# EAGLE design skv_v3 (EAGLE 6.5.0)
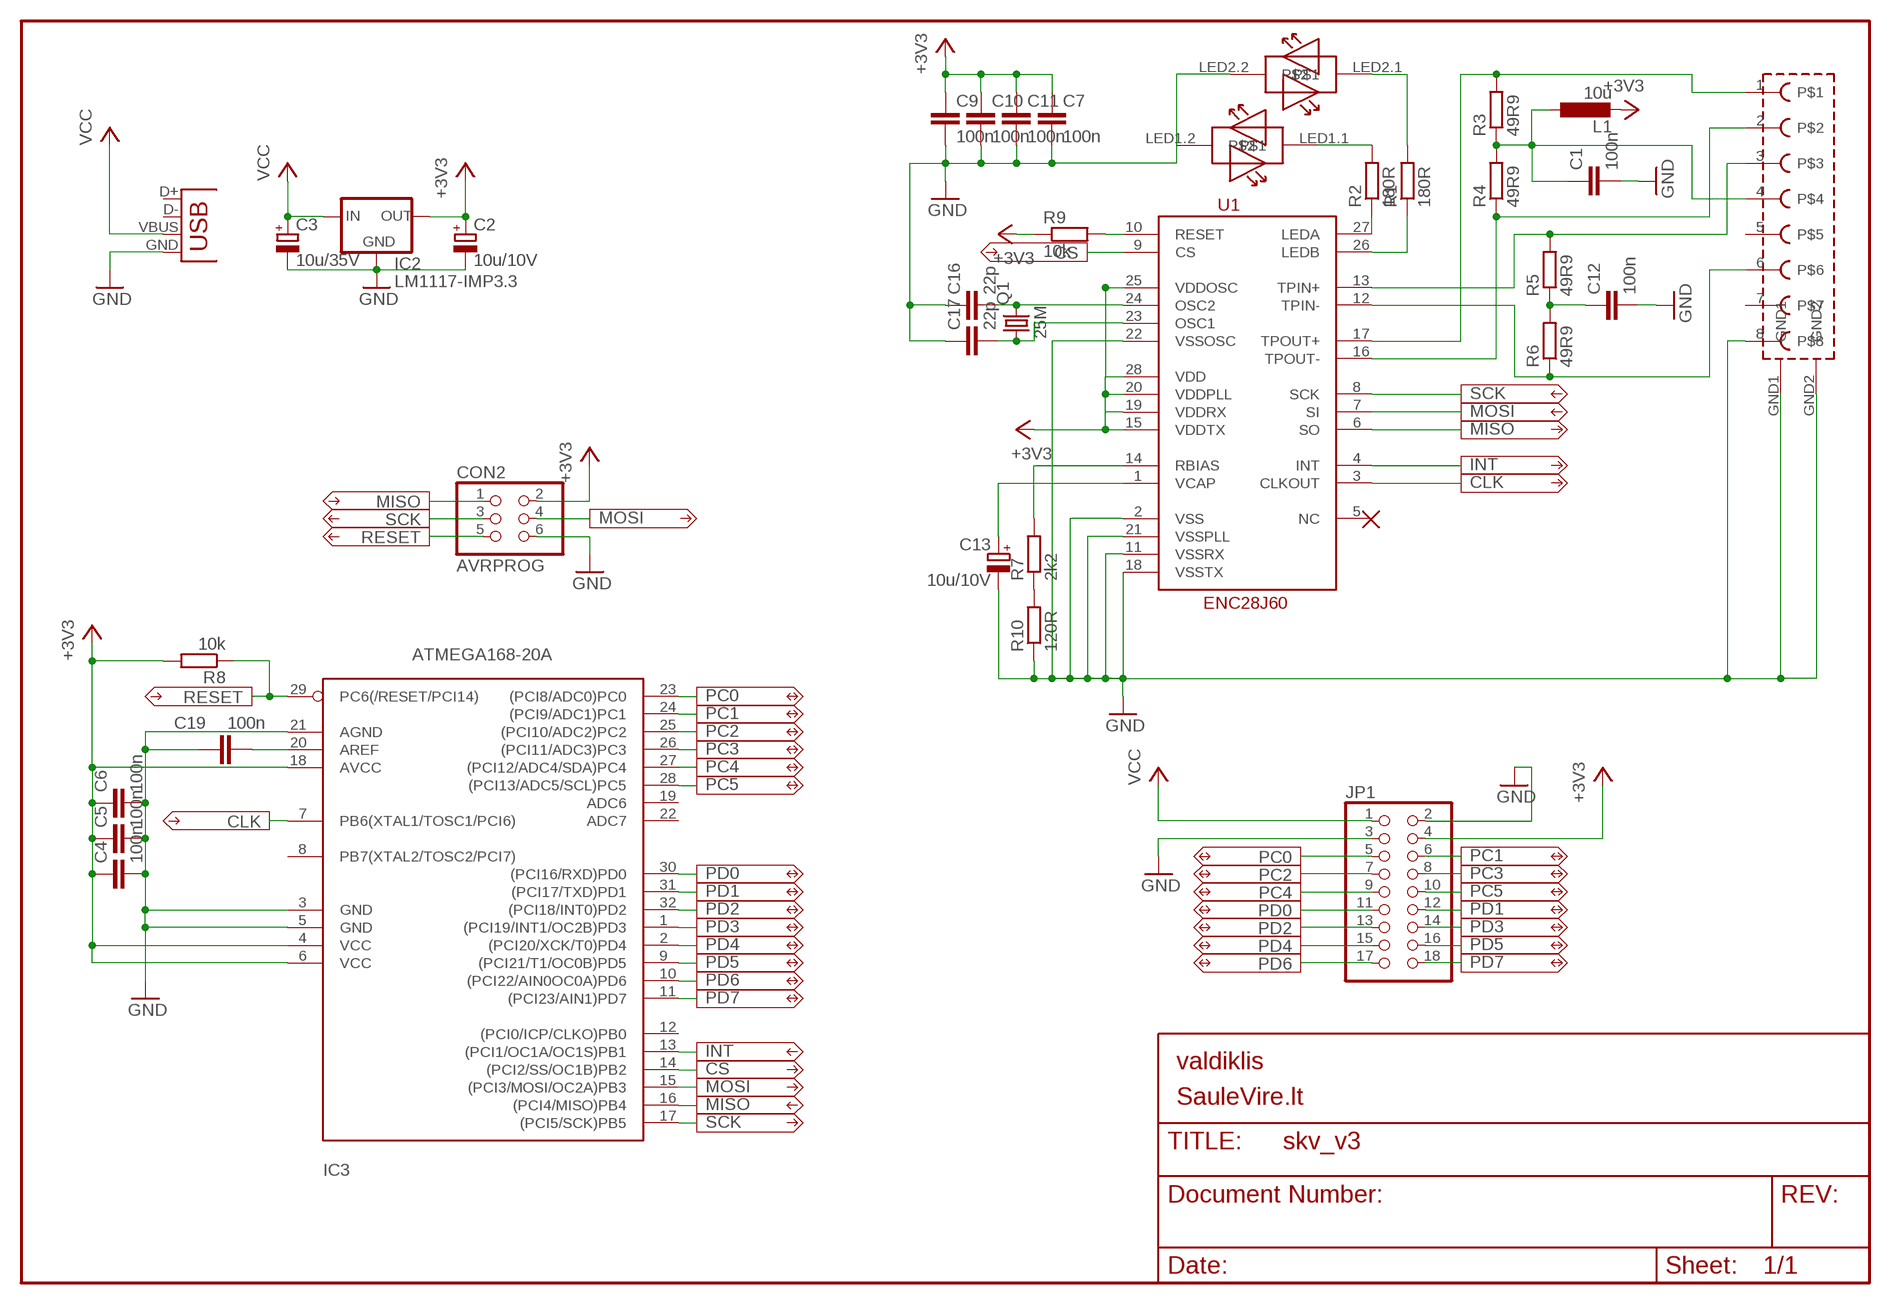
[diagram p0: schematic, sheet 1]

## Parts
C1  100n  C-EUC0805  [C0805]
C2  10u/10V  CPOL-EUSMCA  [SMC_A]
C3  10u/35V  CPOL-EUSMCC  [SMC_C]
C4  100n  C-EUC0805  [C0805]
C5  100n  C-EUC0805  [C0805]
C6  100n  C-EUC0805  [C0805]
C7  100n  C-EUC0805  [C0805]
C9  100n  C-EUC0805  [C0805]
C10  100n  C-EUC0805  [C0805]
C11  100n  C-EUC0805  [C0805]
C12  100n  C-EUC0805  [C0805]
C13  10u/10V  CPOL-EUSMCA  [SMC_A]
C16  22p  C-EUC0805  [C0805]
C17  22p  C-EUC0805  [C0805]
C19  100n  C-EUC0805  [C0805]
CON2  AVRPROG  PINHD-2X3_2.54  [2X03]
IC2  LM1117-IMP3.3  LM1117  [SOT223]
IC3  ATMEGA168-20A  [TQFP32-08]
JP1  PINHD-2X9  [2X09]
L1  10u  L-EU0207/10  [0207/10]
MAGJACK  MAGJACK  [MAGJACK]
Q1  25M  CRYSTALHC49UP  [HC49UP]
R1  180R  R-EU_R0805  [R0805]
R2  180R  R-EU_R0805  [R0805]
R3  49R9  R-EU_R0805  [R0805]
R4  49R9  R-EU_R0805  [R0805]
R5  49R9  R-EU_R0805  [R0805]
R6  49R9  R-EU_R0805  [R0805]
R7  2k2  R-EU_R0805  [R0805]
R8  10k  R-EU_R0805  [R0805]
R9  10k  R-EU_R0805  [R0805]
R10  120R  R-EU_R0805  [R0805]
U1  ENC28J60-1  [SSOP28]
X1  USB-MICROB  [USB-MICROB]

## Nets
+3V3: C2.+ C4.1 C5.1 C6.1 C7.1 C9.1 C10.1 C11.1 CON2.2 IC2.2(OUT) IC3.4(VCC) IC3.6(VCC) IC3.18(AVCC) JP1.4 L1.2 R8.2 R9.1 U1.15(VDDTX) U1.19(VDDRX) U1.20(VDDPLL) U1.25(VDDOSC) U1.28(VDD)
CLK: IC3.7(PB6(XTAL1/TOSC1/PCI6)) U1.3(CLKOUT)
CS: IC3.14((PCI2/SS/OC1B)PB2) U1.9(CS)
GND: C1.2 C2.- C3.- C4.2 C5.2 C6.2 C7.2 C9.2 C10.2 C11.2 C12.2 C13.- C16.1 C17.1 C19.1 CON2.6 IC2.1(GND) IC3.3(GND) IC3.5(GND) IC3.21(AGND) JP1.2 JP1.3 MAGJACK.8 MAGJACK.GND1 MAGJACK.GND2 MAGJACK.LED1.2 MAGJACK.LED2.2 R10.1 U1.2(VSS) U1.11(VSSRX) U1.18(VSSTX) U1.21(VSSPLL) U1.22(VSSOSC) X1.GND
INT: IC3.13((PCI1/OC1A/OC1S)PB1) U1.4(INT)
MISO: CON2.1 IC3.16((PCI4/MISO)PB4) U1.6(SO)
MOSI: CON2.4 IC3.15((PCI3/MOSI/OC2A)PB3) U1.7(SI)
N$1: R7.1 R10.2
N$9: C13.+ U1.1(VCAP)
N$10: R7.2 U1.14(RBIAS)
N$11: C17.2 Q1.1 U1.23(OSC1)
N$12: C16.2 Q1.2 U1.24(OSC2)
N$14: R2.1 U1.27(LEDA)
N$16: C19.2 IC3.20(AREF)
N$33: R1.1 U1.26(LEDB)
N$36: MAGJACK.LED1.1 R2.2
N$37: R9.2 U1.10(RESET)
N$39: MAGJACK.LED2.1 R1.2
N$40: C1.1 L1.1 MAGJACK.4 R3.1 R4.2
N$41: C12.1 R5.1 R6.2
N$42: MAGJACK.6 R6.1 U1.12(TPIN-)
N$43: MAGJACK.3 R5.2 U1.13(TPIN+)
N$44: MAGJACK.2 R4.1 U1.16(TPOUT-)
N$45: MAGJACK.1 R3.2 U1.17(TPOUT+)
PC0: IC3.23((PCI8/ADC0)PC0) JP1.5
PC1: IC3.24((PCI9/ADC1)PC1) JP1.6
PC2: IC3.25((PCI10/ADC2)PC2) JP1.7
PC3: IC3.26((PCI11/ADC3)PC3) JP1.8
PC4: IC3.27((PCI12/ADC4/SDA)PC4) JP1.9
PC5: IC3.28((PCI13/ADC5/SCL)PC5) JP1.10
PD0: IC3.30((PCI16/RXD)PD0) JP1.11
PD1: IC3.31((PCI17/TXD)PD1) JP1.12
PD2: IC3.32((PCI18/INT0)PD2) JP1.13
PD3: IC3.1((PCI19/INT1/OC2B)PD3) JP1.14
PD4: IC3.2((PCI20/XCK/T0)PD4) JP1.15
PD5: IC3.9((PCI21/T1/OC0B)PD5) JP1.16
PD6: IC3.10((PCI22/AIN0OC0A)PD6) JP1.17
PD7: IC3.11((PCI23/AIN1)PD7) JP1.18
RESET: CON2.5 IC3.29(PC6(/RESET/PCI14)) R8.1
SCK: CON2.3 IC3.17((PCI5/SCK)PB5) U1.8(SCK)
VCC: C3.+ IC2.3(IN) JP1.1 X1.VBUS
Unconnected: IC3.8(PB7(XTAL2/TOSC2/PCI7)) IC3.12((PCI0/ICP/CLKO)PB0) IC3.19(ADC6) IC3.22(ADC7) MAGJACK.5 MAGJACK.7 U1.5(NC) X1.D+ X1.D-

## Notes on the sheet
- valdiklis
- SauleVire.lt

## Library data of the parts
C1 C4-C7 C9-C12 C16 C17 C19 = rcl:C-EU: CAPACITOR, European symbol
C2 C3 C13 = rcl:CPOL-EU: POLARIZED CAPACITOR, European symbol
CON2 = pinhead:PINHD-2X3: PIN HEADER
IC2 = v-reg-2:LM1117
IC3 = avr:ATMEGA168: MICROCONTROLLER 16 kBytes FLASH 1 kBytes SRAM 512 Bytes EEPROM USART 8-channel 10 bit ADC
JP1 = pinhead:PINHD-2X9: PIN HEADER
L1 = rcl:L-EU: INDUCTOR, European symbol
MAGJACK = magjacksmalldrill:MAGJACK
Q1 = crystal:CRYSTAL: CRYSTAL
R1-R10 = rcl:R-EU_: RESISTOR, European symbol
U1 = microchip-enc28j60:ENC28J60-1
X1 = SparkFun:USB: USB Connectors USB-B-PTH is fully proven SKU : PRT-00139 USB-miniB is fully proven SKU : PRT-00587 USB-A-PCB is untested. USB-A-H is throughly reviewed, but untested. Spark Fun Electronics SKU : PRT-00437 USB-B-SMT is throughly reviewed, but untested. Needs silkscreen touching up. USB-A-S has not been used/tested USB-MB-H has not been used/tested

## Board
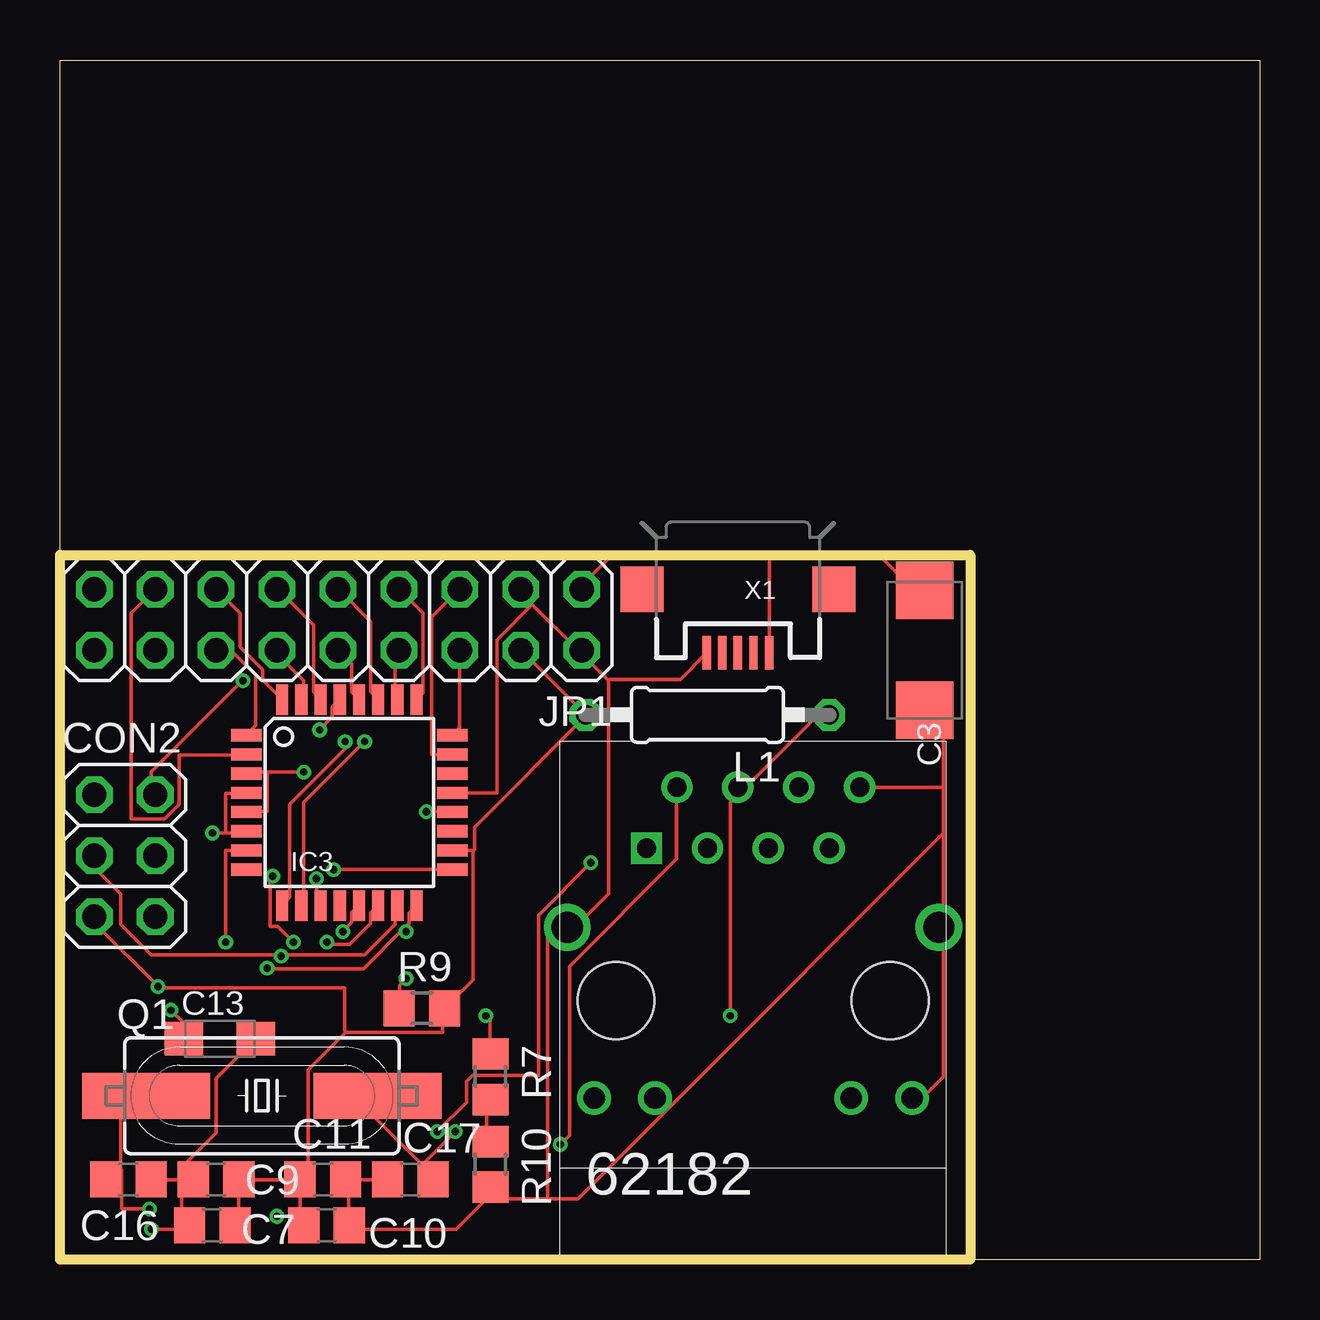
[diagram p1: board, top side]
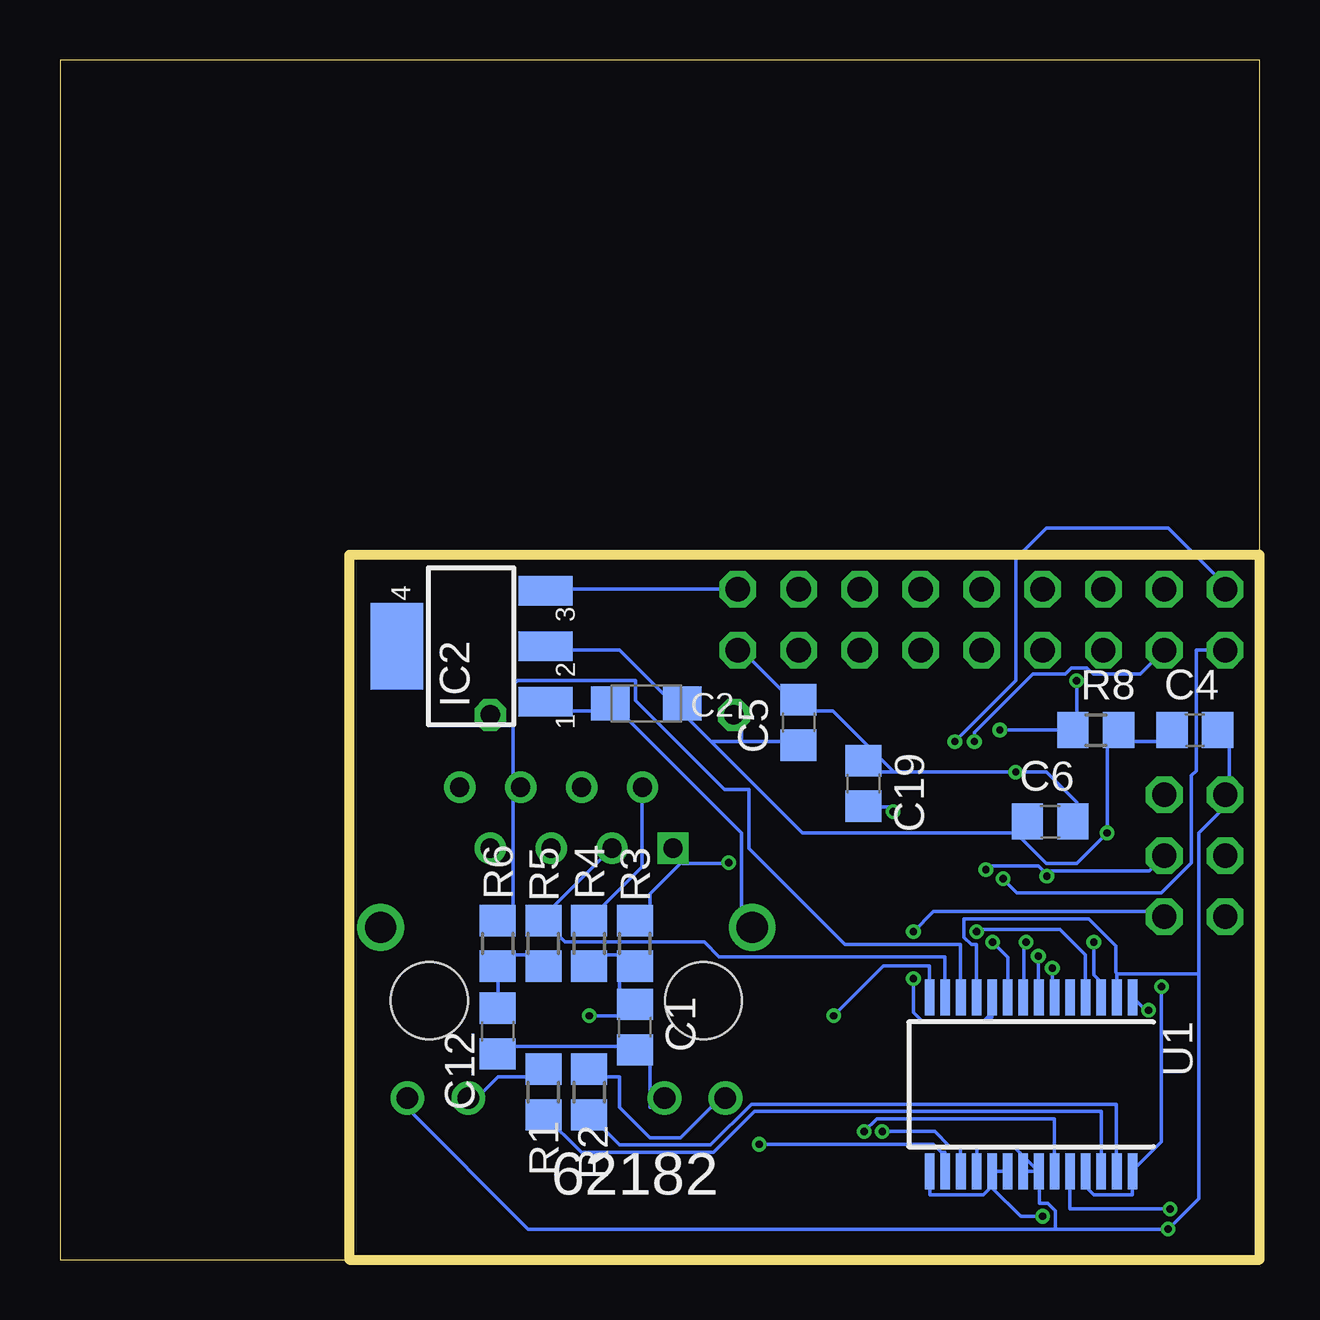
[diagram p2: board, bottom side, seen from below]

Size 50 x 50 mm. Coordinates in mm from the lower left corner, seen from the top.
Outline: 0,0 0,50 50,50 50,0 0,0
Copper layers (1*16): Top 0.035mm / dielectric 1.5mm / Bottom 0.035mm
Design rules "ITEADstudio_DRC": minimum track width 6mil, minimum drill 12mil, track to track 6mil, track to pad 6mil, pad to pad 6mil, via to via 6mil, smd to smd 0mil, copper to edge 10mil, drill to drill 10mil, minimum pad ring 10mil, minimum via ring 6mil, stop-mask expansion 2mil, vias tented up to drill 100mil, thermal gap 10mil
Milling: 4 lines

### Footprints (pad centres in the part's own frame; a part is rotated, then mirrored left to right if it is on the bottom)
C0805 = smd 1.3 x 1.5: 1 -0.95,0; 2 0.95,0
SMC_A = smd 1.6 x 1.4: + -1.5,0; - 1.5,0
SMC_C = smd 2.4 x 2.4: + -2.5,0; - 2.5,0
2X03 = drill 1.016 octagon: 1 -2.54,-1.27; 2 -2.54,1.27; 3 0,-1.27; 4 0,1.27; 5 2.54,-1.27; 6 2.54,1.27
SOT223 = smd 1.219 x 2.235: 1 -2.311,-3.099; 2 0,-3.099; 3 2.311,-3.099 | smd 3.6 x 2.2: 4 0,3.099
TQFP32-08 = smd 1.27 x 0.508: 1 -4.293,2.8; 2 -4.293,2; 3 -4.293,1.2; 4 -4.293,0.4; 5 -4.293,-0.4; 6 -4.293,-1.2; 7 -4.293,-2; 8 -4.293,-2.8; 17 4.293,-2.8; 18 4.293,-2; 19 4.293,-1.2; 20 4.293,-0.4; 21 4.293,0.4; 22 4.293,1.2; 23 4.293,2; 24 4.293,2.8 | smd 0.508 x 1.27: 9 -2.8,-4.293; 10 -2,-4.293; 11 -1.2,-4.293; 12 -0.4,-4.293; 13 0.4,-4.293; 14 1.2,-4.293; 15 2,-4.293; 16 2.8,-4.293; 25 2.8,4.293; 26 2,4.293; 27 1.2,4.293; 28 0.4,4.293; 29 -0.4,4.293; 30 -1.2,4.293; 31 -2,4.293; 32 -2.8,4.293
2X09 = drill 1.016 octagon: 1 -10.16,-1.27; 2 -10.16,1.27; 3 -7.62,-1.27; 4 -7.62,1.27; 5 -5.08,-1.27; 6 -5.08,1.27; 7 -2.54,-1.27; 8 -2.54,1.27; 9 0,-1.27; 10 0,1.27; 11 2.54,-1.27; 12 2.54,1.27; 13 5.08,-1.27; 14 5.08,1.27; 15 7.62,-1.27; 16 7.62,1.27; 17 10.16,-1.27; 18 10.16,1.27
0207/10 = drill 0.813 octagon: 1 -5.08,0; 2 5.08,0
MAGJACK = drill 0.8 square: 1 -4.445,6.35 | drill 0.8: 2 -3.175,8.89; 3 -1.905,6.35; 4 -0.635,8.89; 5 0.635,6.35; 6 1.905,8.89; 7 3.175,6.35; 8 4.445,8.89 | drill 1.3: GND1 -7.747,3.048; GND2 7.747,3.048 | drill 0.9: LED1.1 -6.629,-4.064; LED1.2 -4.089,-4.064; LED2.1 4.089,-4.064; LED2.2 6.629,-4.064 | hole 3.2: -5.715,0; 5.715,0
HC49UP = smd 5.334 x 1.93: 1 -4.826,0; 2 4.826,0
R0805 = smd 1.3 x 1.5: 1 -0.95,0; 2 0.95,0
SSOP28 = smd 0.4 x 1.5: 1 -4.225,-3.625; 2 -3.575,-3.625; 3 -2.925,-3.625; 4 -2.275,-3.625; 5 -1.625,-3.625; 6 -0.975,-3.625; 7 -0.325,-3.625; 8 0.325,-3.625; 9 0.975,-3.625; 10 1.625,-3.625; 11 2.275,-3.625; 12 2.925,-3.625; 13 3.575,-3.625; 14 4.225,-3.625; 15 4.225,3.625; 16 3.575,3.625; 17 2.925,3.625; 18 2.275,3.625; 19 1.625,3.625; 20 0.975,3.625; 21 0.325,3.625; 22 -0.325,3.625; 23 -0.975,3.625; 24 -1.625,3.625; 25 -2.275,3.625; 26 -2.925,3.625; 27 -3.575,3.625; 28 -4.225,3.625
USB-MICROB = smd 0.35 x 1.4: D+ 0,2.65; D- -0.65,2.65; GND 1.3,2.65; ID 0.65,2.65; VBUS -1.3,2.65 | smd 1.8 x 1.9: MT1 -4,0; MT2 4,0

### Placement (x,y rotation side)
C1  26.04,9.68 270 bottom
C2  25.56,23.18 180 bottom
C3  36.04,25.4 270 top
C4  2.7,22.07 0 bottom
C5  19.21,22.38 90 bottom
C6  8.73,18.26 0 bottom
C7  6.35,1.43 180 top
C9  6.51,3.33 180 top
C10  11.11,1.43 0 top
C11  10.95,3.33 0 top
C12  31.75,9.53 270 bottom
C13  6.67,9.21 0 top
C16  2.86,3.33 180 top
C17  14.61,3.33 0 top
C19  16.51,19.84 270 bottom
CON2  2.7,16.83 90 top
IC2  32.86,25.56 90 bottom
IC3  12.06,19.05 0 top
JP1  11.59,26.67 180 top
L1  26.99,22.7 180 top
MAGJACK  28.89,10.8 0 top
Q1  8.41,6.83 180 top
R1  29.84,6.98 90 bottom
R2  27.94,6.98 90 bottom
R3  26.04,13.18 90 bottom
R4  27.94,13.18 270 bottom
R5  29.85,13.18 90 bottom
R6  31.75,13.18 270 bottom
R7  17.94,7.62 90 top
R8  6.83,22.07 0 bottom
R9  15.08,10.48 180 top
R10  17.94,3.97 90 top
U1  9.53,7.3 180 bottom
X1  28.26,27.94 180 top

### Tracks (layer width: path | path; a pad name or v marks a point on that pad's centre or on a via)
+3V3  (via drill 0.3)
  Top 0.152: v6.35,17.78 6.91,17.78 | 6.91,17.78 7.62,17.78 IC3.6 | 6.91,17.78 6.91,19.43 7.77,19.43 IC3.4 | CON2.2 1.45,14.28 1.45,14.02 v4.09,11.38 4.14,11.33 11.86,11.33 11.86,9.53 11.91,9.47 | JP1.4 19.23,25.4 21.89,22.73 21.89,22.71 L1.2 21.89,22.63 17.27,18.01 17.27,17.09 17.22,17.04 | C11.1 10.01,1.6 10.16,1.45 C10.1 9.96,1.8 v9.04,1.8 | C7.1 7.32,1.45 7.44,1.57 7.44,3.33 C9.1 7.52,3.33 9.93,3.33 C11.1 | 17.22,17.04 IC3.18 | 17.22,17.04 17.22,11.66 16.05,10.49 R9.1 15.95,10.46 15.95,9.47 11.91,9.47 | 11.91,9.47 10.34,7.9 10.34,3.71 10.03,3.4 C11.1
  Bottom 0.152: 6.35,21.59 v6.35,17.78 7.62,16.51 8.89,16.51 10.16,17.78 | 6.35,21.59 3.81,21.59 C4.1 | 6.35,21.59 R8.2 | 10.16,17.78 19.05,17.78 22.86,21.59 | 24.13,22.86 22.86,21.59 | 22.86,21.59 21.59,21.59 | 21.59,21.59 19.05,21.59 C5.1 | 24.13,22.86 26.67,25.4 29.21,25.4 IC2.2 | 24.13,22.86 C2.+ | 10.16,17.78 C6.1 | 21.59,21.59 21.59,22.86 L1.2 | U1.20 10.52,3.68 11.12,3.68 U1.19 | U1.15 13.74,3.66 13.74,2.69 11.51,2.69 11.18,3.02 11.18,3.61 U1.19 | U1.25 7.24,3.66 7.24,3.02 6.91,2.69 5.31,2.69 5.31,3.66 U1.28 5.26,3.73 4.09,4.9 v4.09,11.38 | v9.04,1.8 9.96,1.8 11.12,2.97 U1.19
CLK  (via drill 0.3)
  Top 0.152: v6.91,13.23 6.91,17.04 IC3.7
  Bottom 0.152: v6.91,13.23 6.91,11.86 6.6,11.56 6.6,10.95 U1.3
CS  (via drill 0.3)
  Top 0.152: v11.12,13.23 11.12,13.13 12.06,13.13 12.95,14.02 12.95,14.45 IC3.14
  Bottom 0.152: v11.12,13.23 10.49,12.6 10.49,10.95 U1.9
GND  (via drill 0.3)
  Top 0.152: 21.59,25.4 19.68,27.3 | 19.68,27.3 19.05,27.94 JP1.3 | v10.16,20.32 8.64,20.32 | 8.64,20.32 7.62,20.32 IC3.3 | 20.32,2.54 21.59,2.54 25.4,6.35 | 20.32,2.54 17.78,2.54 | 17.78,2.54 16.51,1.27 12.7,1.27 C10.2 12.04,1.5 12.04,3.2 11.91,3.33 C11.2 12.01,3.33 13.64,3.33 C17.1 | 17.78,2.54 R10.1 | 20.32,2.54 20.32,13.97 MAGJACK.GND1 21.59,13.97 22.86,15.24 22.86,24.13 | 22.86,24.13 21.59,25.4 | 21.59,25.4 JP1.2 | 36.83,13.97 36.83,17.78 | 36.83,17.78 36.83,19.68 | 36.83,19.68 36.83,22.86 C3.- | 5.08,1.27 5.08,3.81 C9.2 | v3.81,1.27 5.08,1.27 | 5.08,1.27 C7.2 | 36.83,13.97 36.83,7.62 35.56,6.35 MAGJACK.LED2.2 | 36.83,13.97 MAGJACK.GND2 | 36.83,17.78 25.4,6.35 | 25.4,6.35 MAGJACK.LED1.2 | 8.64,20.32 8.64,18.67 7.77,18.67 IC3.5 | 19.68,27.3 18.21,25.83 18.21,19.46 IC3.21 | X1.GND 26.95,25.27 25.86,24.18 22.91,24.18 22.86,24.13 | 36.83,19.68 MAGJACK.8 | C13.- 8.15,9.2 6.5,7.54 6.5,5.28 5.11,3.89 C9.2 | C16.1 5.03,3.33 C9.2
  Bottom 0.152: 19.05,22.86 21.59,25.4 JP1.2 | 15.24,20.32 16.51,20.32 C19.1 | 15.24,20.32 v10.16,20.32 8.89,20.32 7.62,19.05 7.62,17.78 C6.2 | 19.05,22.86 17.78,22.86 15.24,20.32 | 19.05,22.86 C5.2 | 26.67,22.86 29.21,22.86 IC2.1 | 26.67,22.86 21.59,17.78 21.59,13.97 MAGJACK.GND1 | 26.67,22.86 C2.- | MAGJACK.LED1.2 25.4,6.35 25.4,8.89 C1.2 26.67,8.89 31.75,8.89 C12.2 | 1.27,19.05 1.27,21.59 C4.2 | 8.51,1.27 30.48,1.27 35.56,6.35 MAGJACK.LED2.2 | 8.51,1.27 v3.81,1.27 2.54,2.54 2.54,11.91 | 1.27,19.05 2.54,17.78 2.54,11.91 | 1.27,19.05 CON2.6 | U1.22 9.22,3.68 9.83,3.68 U1.21 | U1.18 11.79,3.68 11.79,4.67 10.21,4.67 9.27,3.73 U1.22 | 5.94,11.91 5.94,10.95 U1.2 | 2.54,11.91 5.94,11.91 | U1.11 11.81,10.95 11.81,13.13 12.01,13.13 12.32,13.44 12.32,14.2 7.11,14.2 5.99,13.08 5.99,11.96 5.94,11.91 | 8.51,1.27 8.51,2.03 8.81,2.34 9.17,2.34 9.17,3.61 U1.22
INT  (via drill 0.3)
  Top 0.152: v11.79,13.66 12.17,14.05 12.17,14.48 12.45,14.76 IC3.13
  Bottom 0.152: v11.79,13.66 11.68,13.77 8.33,13.77 7.26,12.7 7.26,10.95 U1.4
MISO  (via drill 0.3)
  Top 0.152: 14.33,13.79 12.65,12.12 8.64,12.12 v8.64,12.14 | 14.33,13.79 14.55,14.02 14.55,14.45 IC3.16 | v14.43,13.66 14.38,13.72 14.38,13.74 14.33,13.79
  Bottom 0.152: v8.64,12.14 8.64,10.95 8.56,10.95 U1.6 | v14.43,13.66 13.59,14.5 4.19,14.5 3.99,14.3 CON2.1
MOSI  (via drill 0.3)
  Top 0.152: 9.22,12.7 3.81,12.7 2.54,13.97 2.54,15.24 1.27,16.51 CON2.4 | 9.22,12.7 12.7,12.7 13.97,13.97 13.97,15.24 IC3.15 | v9.22,12.65 9.22,12.7
  Bottom 0.152: v9.22,12.65 9.22,10.95 U1.7
N$1
  Top 0.152: R10.2 17.78,5.08 17.78,6.35 R7.1
N$9  (via drill 0.3)
  Top 0.152: v4.62,10.39 5.16,9.86 5.16,9.22 C13.+
  Bottom 0.152: v4.62,10.39 4.75,10.39 5.28,10.92 U1.1
N$10  (via drill 0.3)
  Top 0.152: v17.75,10.16 17.93,9.98 17.93,8.59 R7.2
  Bottom 0.152: v17.75,10.16 15.67,12.24 13.77,12.24 13.77,10.95 U1.14
N$11  (via drill 0.3)
  Top 0.152: Q1.1 12.7,6.35 15.24,3.81 C17.2 15.16,3.99 15.16,4.01 v16.48,5.33
  Bottom 0.152: v16.48,5.33 15.95,5.87 8.56,5.87 U1.23
N$12  (via drill 0.3)
  Top 0.152: 2.52,3.79 2.54,3.81 2.54,6.35 Q1.2 | 2.52,3.79 C16.2 | v3.73,2.11 2.56,2.11 2.56,3.73 2.52,3.79
  Bottom 0.152: v3.73,2.11 7.9,2.11 7.9,3.66 U1.24
N$14
  Bottom 0.152: U1.27 5.97,3.68 5.97,6.48 21.18,6.48 22.89,4.78 26.67,4.78 27.91,6.02 R2.1
N$16  (via drill 0.3)
  Top 0.152: v15.27,18.67 16.36,18.67 IC3.20
  Bottom 0.152: v15.27,18.67 15.47,18.87 16.48,18.87 C19.2
N$33
  Bottom 0.152: U1.26 6.6,6.17 21.06,6.17 22.76,4.47 28.27,4.47 29.82,6.02 R1.1
N$36
  Bottom 0.152: R2.2 27.94,7.62 26.67,7.62 26.67,6.35 25.4,5.08 24.13,5.08 22.86,6.35 MAGJACK.LED1.1
N$37  (via drill 0.3)
  Top 0.152: v14.43,11.71 14.15,11.43 14.15,10.49 R9.2
  Bottom 0.152: v14.43,11.71 14.43,10.31 14.05,9.93 11.51,9.93 11.35,10.08 11.15,10.08 11.15,10.85 U1.10
N$39
  Bottom 0.152: R1.2 30.48,7.62 31.75,7.62 33.02,6.35 MAGJACK.LED2.1
N$40  (via drill 0.3)
  Top 0.152: 28.42,19.53 27.94,19.05 v27.94,10.16 | 28.42,19.53 31.75,22.86 L1.1 | 28.42,19.53 MAGJACK.4
  Bottom 0.152: 26.67,12.7 26.67,10.16 | 26.67,12.7 27.94,12.7 R4.2 | 26.67,12.7 R3.1 | 26.67,10.16 v27.94,10.16 | 26.67,10.16 C1.1
N$41
  Bottom 0.152: 31.75,12.7 30.48,12.7 R5.1 | 31.75,12.7 31.75,10.16 C12.1 | 31.75,12.7 R6.2
N$42
  Bottom 0.152: U1.12 12.47,10.95 12.47,13.13 17.27,13.13 21.29,17.14 21.29,19.58 22.3,19.58 26.01,23.29 26.01,24.13 30.94,24.13 31.11,23.95 31.11,19.71 30.81,19.71 MAGJACK.6 31.11,19.66 31.11,14.78 31.75,14.15 R6.1
N$43
  Bottom 0.152: U1.13 13.11,10.95 13.11,12.62 22.53,12.62 23.14,13.23 28.96,13.23 R5.2 29.82,14.2 29.82,14.33 MAGJACK.3
N$44  (via drill 0.3)
  Top 0.152: v20.85,4.8 21.23,5.18 21.23,12.22 25.7,16.69 25.7,19.68 MAGJACK.2
  Bottom 0.152: v20.85,4.8 13.59,4.8 13.26,4.47 13.11,4.47 U1.16 | R4.1 27.94,14.15 25.73,16.36 MAGJACK.2
N$45  (via drill 0.3)
  Top 0.152: v15.72,5.33 16.94,6.55 16.94,7.42 17.2,7.67 19.94,7.67 19.94,14.35 v22.12,16.54
  Bottom 0.152: R3.2 25.4,13.97 25.4,15.24 24.13,16.51 MAGJACK.1 24.05,16.51 22.15,16.51 v22.12,16.54 | v15.72,5.33 13.54,5.33 12.93,4.72 12.47,4.72 12.47,3.68 U1.17
PC0
  Top 0.152: IC3.23 15.49,21.06 15.49,26.77 JP1.5
PC1
  Top 0.152: IC3.24 16.36,21.87 16.66,22.17 JP1.6
PC2
  Top 0.152: IC3.25 14.88,23.37 15.14,23.62 15.14,26.95 14.15,27.94 JP1.7
PC3
  Top 0.152: IC3.26 13.97,22.86 13.97,25.4 JP1.8
PC4
  Top 0.152: IC3.27 13.26,23.37 12.95,23.67 12.95,26.59 11.61,27.94 JP1.9
PC5
  Top 0.152: IC3.28 12.45,23.37 12.17,23.65 12.17,24.84 11.61,25.4 JP1.10
PD0
  Top 0.152: IC3.30 10.85,23.37 10.57,23.65 10.57,26.44 9.07,27.94 JP1.11
PD1
  Top 0.152: IC3.31 10.16,22.86 10.16,24.13 8.89,25.4 JP1.12
PD2
  Top 0.152: IC3.32 9.25,23.37 8.46,24.16 8.46,24.59 7.52,25.53 7.52,26.95 6.53,27.94 JP1.13
PD3
  Top 0.152: JP1.14 7.11,25.4 8.15,24.36 8.15,22.25 7.77,21.87 IC3.1
PD4
  Top 0.152: IC3.2 7.77,21.03 4.98,21.03 4.98,18.97 4.37,18.36 2.97,18.36 2.97,26.95 JP1.15
PD5  (via drill 0.3)
  Top 0.152: v11.89,21.59 11.89,21.29 9.58,18.97 9.58,15.09 9.27,14.78 IC3.9
  Bottom 0.152: v11.89,21.59 11.89,21.97 9.45,24.41 8.1,24.41 7.85,24.66 7.19,24.66 6.93,24.41 4.98,24.41 3.99,25.4 JP1.16
PD6  (via drill 0.3)
  Top 0.152: v12.7,21.59 10.16,19.05 10.16,15.24 IC3.10
  Bottom 0.152: v12.7,21.59 10.16,24.13 10.16,29.21 8.89,30.48 3.81,30.48 1.27,27.94 JP1.17
PD7  (via drill 0.3)
  Top 0.152: v10.69,15.88 10.69,14.94 10.85,14.78 IC3.11
  Bottom 0.152: v10.69,15.88 10.11,15.29 4.09,15.29 2.85,16.54 2.85,20.17 2.64,20.37 2.64,25.4 JP1.18
RESET  (via drill 0.3)
  Top 0.152: v7.62,24.13 3.81,20.32 3.81,19.05 CON2.5 | v10.82,22.07 11.35,22.61 11.35,23.04 IC3.29
  Bottom 0.152: v7.62,24.13 7.62,21.59 R8.1 7.85,22.07 v10.82,22.07
SCK  (via drill 0.3)
  Top 0.152: v11.4,16.26 IC3.17 | v9.73,13.23 9.07,13.89 8.76,13.89 8.76,15.88 v8.87,15.98
  Bottom 0.152: v11.4,16.26 11.25,16.41 9.22,16.41 9.02,16.2 8.87,16.2 | 8.87,16.2 4.6,16.2 3.99,16.82 CON2.3 | v9.73,13.23 9.83,13.23 9.83,10.95 U1.8 | 8.87,16.2 v8.87,15.98
VCC
  Top 0.152: 29.57,29.21 22.86,29.21 21.59,27.94 JP1.1 | 29.57,29.21 34.29,29.21 35.56,27.94 C3.+ | 29.57,29.21 X1.VBUS
  Bottom 0.152: IC2.3 29.21,27.94 JP1.1 21.59,27.94

### Text on the board
tPlace: 62182
bPlace: 62182